# EAGLE design board (EAGLE 5.10)
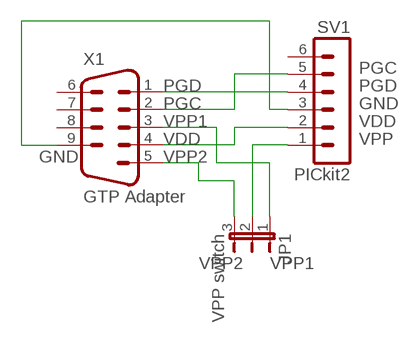
[diagram p0: schematic, sheet 1]

## Parts
JP1  VPP switch  JP2E  [JP2]
SV1  PICkit2  MA06-1  [MA06-1]
X1  GTP Adapter  M09HP  [M09HP]

## Nets
GND: SV1.3 X1.9
PGC: SV1.5 X1.2
PGD: SV1.4 X1.1
VDD: SV1.2 X1.4
VPP: JP1.2 SV1.1
VPP1: JP1.1 X1.3
VPP2: JP1.3 X1.5
Unconnected: SV1.6 X1.6 X1.7 X1.8

## Library data of the parts
JP1 = jumper:JP2E: JUMPER
SV1 = con-lstb:MA06-1: PIN HEADER
X1 = con-subd:M09: SUB-D

## Board
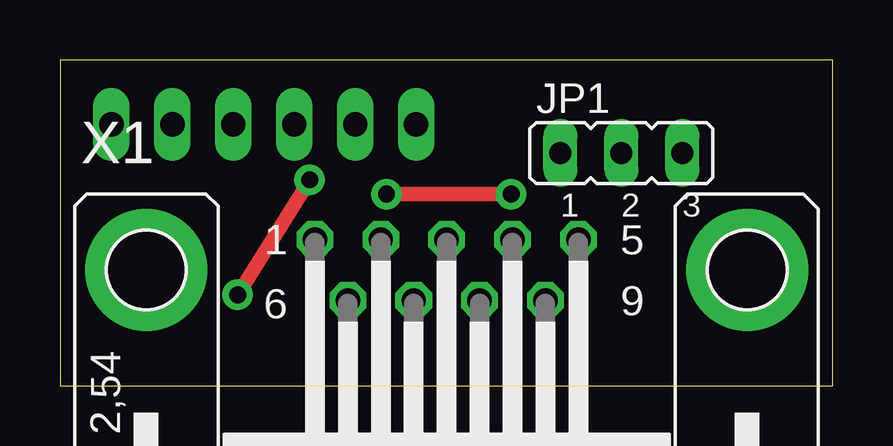
[diagram p1: board, top side]
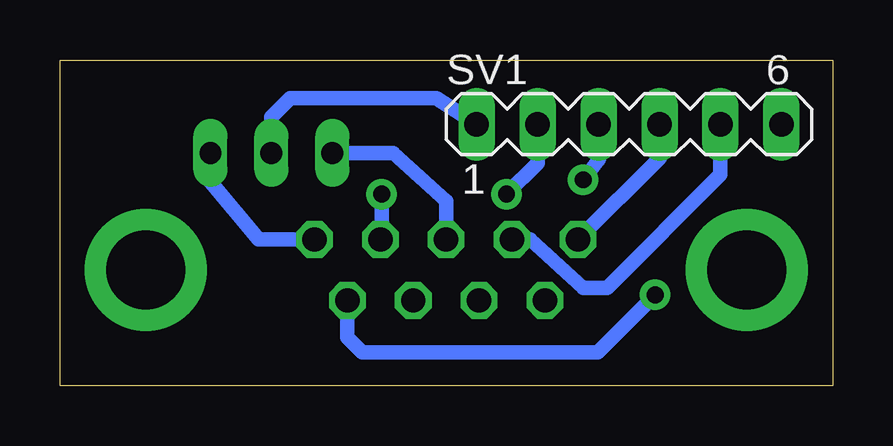
[diagram p2: board, bottom side, seen from below]

Size 32.2 x 13.6 mm. Coordinates in mm from the lower left corner, seen from the top.
Outline: 0,0 32.2,0 32.2,13.6 0,13.6 0,0
Copper layers (1*16): Top 0.035mm / dielectric 1.5mm / Bottom 0.035mm
Design rules "default": minimum track width 10mil, minimum drill 24mil, track to track 8mil, track to pad 8mil, pad to pad 8mil, via to via 8mil, smd to smd 8mil, copper to edge 40mil, drill to drill 8mil, minimum pad ring 10mil, minimum via ring 8mil, stop-mask expansion 4mil, vias tented up to drill 0mil, thermal gap 10mil

### Footprints (pad centres in the part's own frame; a part is rotated, then mirrored left to right if it is on the bottom)
JP2 = drill 0.914 long: 1 -2.54,0; 2 0,0; 3 2.54,0
MA06-1 = drill 1.016 long: 1 -6.35,0; 2 -3.81,0; 3 -1.27,0; 4 1.27,0; 5 3.81,0; 6 6.35,0
M09HP = drill 1.016 octagon: 1 -5.486,1.27; 2 -2.743,1.27; 3 0,1.27; 4 2.743,1.27; 5 5.486,1.27; 6 -4.115,-1.27; 7 -1.372,-1.27; 8 1.372,-1.27; 9 4.115,-1.27 | drill 3.302 pad 5.08 round: G1 -12.522,0; G2 12.522,0

### Placement (x,y rotation side)
JP1  23.39,9.72 0 top
SV1  8.49,10.92 0 bottom
X1  16.11,4.84 0 top

### Tracks (layer width: path | path; a pad name or v marks a point on that pad's centre or on a via)
GND  (via drill 0.7 pad 1.27)
  Top 0.61: v10.4,8.6 v7.4,3.8
  Bottom 0.61: SV1.3 9.76,9.44 v10.4,8.6 | X1.9 20.23,2.02 19.6,1.4 9.8,1.4 v7.4,3.8
PGC
  Bottom 0.61: X1.2 12.61,6.11 10.4,4.1 9.4,4.1 4.68,8.82 SV1.5
PGD
  Bottom 0.61: X1.1 7.22,9.51 SV1.4
VDD  (via drill 0.7 pad 1.27)
  Top 0.61: v18.8,8 v13.6,8
  Bottom 0.61: X1.4 18.8,6.16 v18.8,8 | SV1.2 12.3,9.3 v13.6,8
VPP
  Bottom 0.61: JP1.2 23.39,11.21 22.6,12 16.52,12 SV1.1
VPP1
  Bottom 0.61: JP1.1 18.32,9.72 16.11,7.71 X1.3
VPP2
  Bottom 0.61: X1.5 23.91,6.11 25.93,8.53 JP1.3